# Altium project 230408 BSPD Current Sense Board R2.PrjPcb
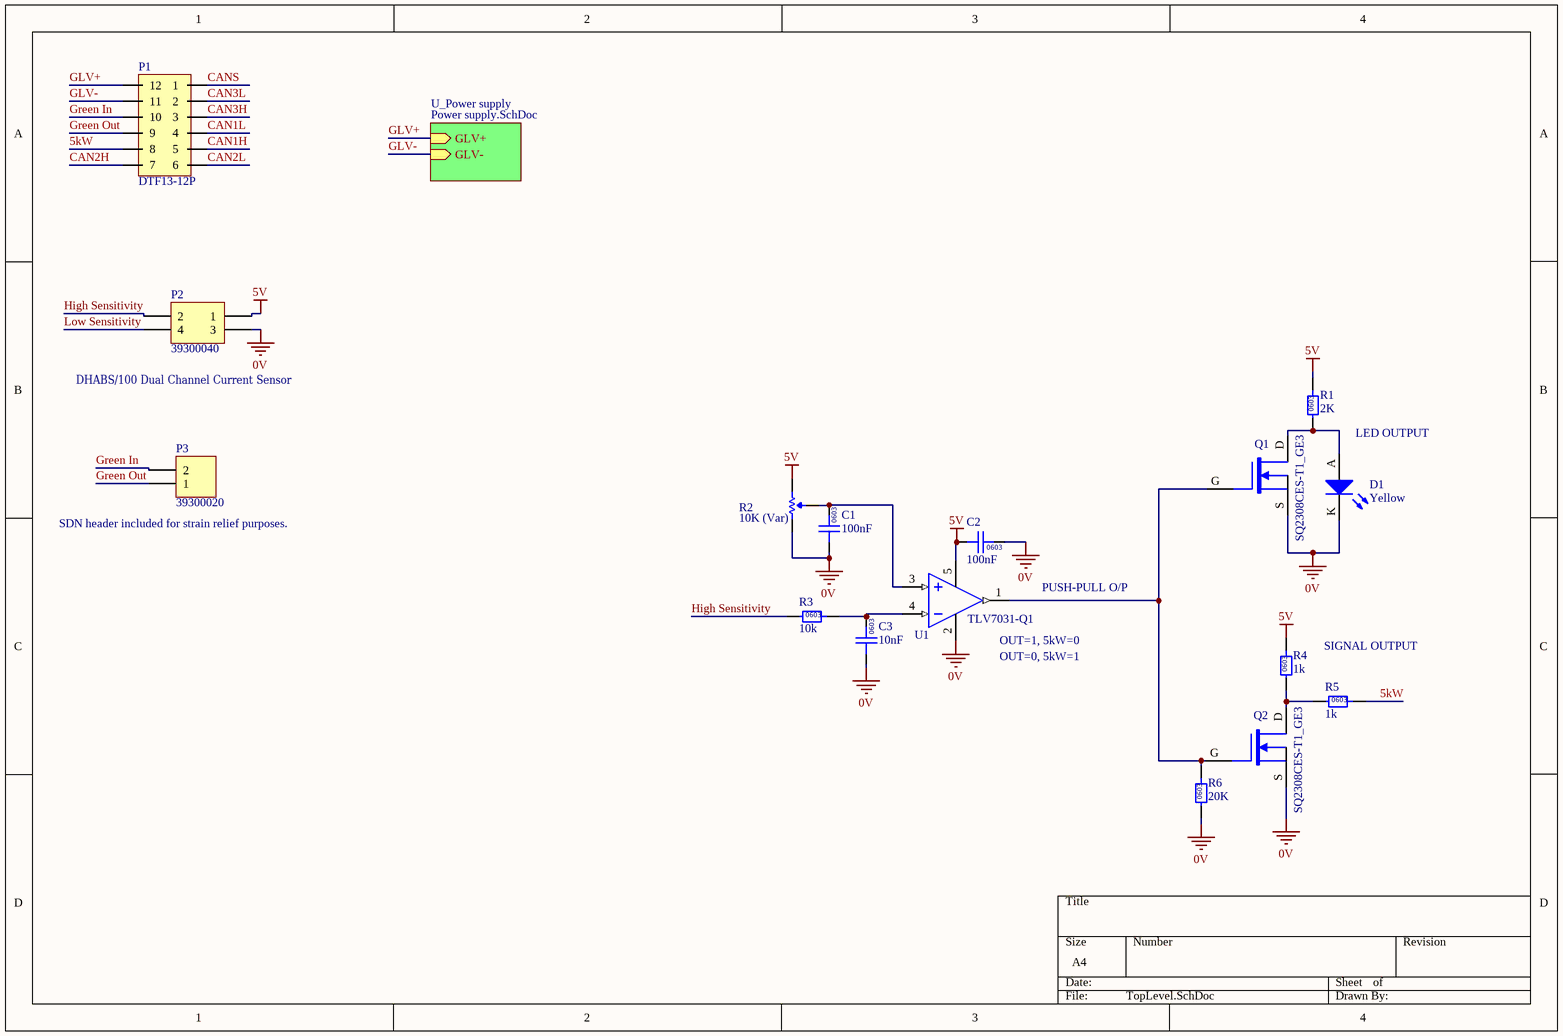
[diagram p0: TopLevel.SchDoc]
2 sheets, 36 parts. Net scope: hierarchical (ports join the sheet entries above them; power ports are global).
Board file: PCB.PcbDoc
Sheets:
  TopLevel.SchDoc
    U_Power supply = Power supply.SchDoc

## Sheet TopLevel.SchDoc
size A4

### Parts
C1  100nF  [0603]
C2  100nF  [0603]
C3  10nF  [0603]
D1  Yellow  [0805 LED]
P1  DTF13-12P  [DTF13-12P]
P2  39300040  [39300040]
P3  39300020  [39300020]
Q1  SQ2308CES-T1_GE3  [VSHY SOT-23-3]
Q2  SQ2308CES-T1_GE3  [VSHY SOT-23-3]
R1  2K  [0603]
R2  10K (Var)  [B 3296]
R3  10k  [0603]
R4  1k  [0603]
R5  1k  [0603]
R6  20K  [0603]
U1  TLV7031-Q1  [TI SOT-23-5]

### Sub-sheets
U_Power supply = Power supply.SchDoc: GLV+ (in), GLV- (in)

### Nets
0V: C1.1 C2.2 C3.1 D1.K P2.3 Q1.S Q2.S R2.3(CW) R6.1 U1.2(V-)
5V: C2.1 P2.1 R1.2 R2.1(CCW) R4.2 U1.5(Vcc)
5kW: P1.8 R5.2
CAN1H: P1.5
CAN1L: P1.4
CAN2H: P1.7
CAN2L: P1.6
CAN3H: P1.3
CAN3L: P1.2
CANS: P1.1
GLV+: P1.12 ; sheet U_Power supply/GLV+
GLV-: P1.11 ; sheet U_Power supply/GLV-
Green In: P1.10 P3.2
Green Out: P1.9 P3.1
High Sensitivity: P2.2 R3.1
Low Sensitivity: P2.4
NetC1_2: C1.2 R2.2(Wiper) U1.3(IN+)
NetC3_2: C3.2 R3.2 U1.4(IN-)
NetD1_A: D1.A Q1.D R1.1
NetQ1_G: Q1.G Q2.G R6.2 U1.1(OUT)
NetQ2_D: Q2.D R4.1 R5.1

### Notes on the sheet
- (near P2) DHAB​​S/100 Dual Channel Current Sensor
- LED OUTPUT
- (near P3) SDN header included for strain relief purposes.
- (near U1) OUT=1, 5kW=0
- PUSH-PULL O/P
- SIGNAL OUTPUT
- (near U1) OUT=0, 5kW=1
- (in symbol GCM188L81H103KA03D) 0603
- (in symbol GCM188L81H104KA57D) 0603
- (in symbol RC0603FR-071KL) 0603
- (in symbol RC0603FR-072KL) 0603
- (in symbol RC0603FR-0710KL) 0603
- (in symbol RC0603FR-0720KL) 0603

### Library data of the parts
C1 C2 = GCM188L81H104KA57D: Manufacturer: muRata; Rated Voltage: 50V; Tolerance: ±10%; Material: MLCC; Temperature Rating: X8L; Part Number: GCM188L81H104KA57D; Value: 100nF; Digikey Part Number: 490-6049-1-ND
C3 = GCM188L81H103KA03D: Manufacturer: muRata; Rated Voltage: 50V; Tolerance: ±10%; Material: MLCC; Temperature Rating: X8L; Part Number: GCM188L81H103KA03D; Value: 10nF; Digikey Part Number: 490-GCM188L81H103KA03DCT-ND
D1 = SML-211YTT86: Yellow LED Indication - Discrete 1.75V 0805 (2012 Metric); Manufacturer: ROHM Semiconductor; Part Number: SML-211YTT86; Colour: Yellow; Digikey Part Number: 511-1293-1-ND
P1 = DTF13-12P: Positions: 12; Pitch: 4.45mm; Angle: 90; Flange: No; Contact: Copper Alloy; Part Number: DTF13-12P; Row Spacing: 4.45mm; Digikey Part Number: 1734-1861-ND; Digikey Link: https://www.digikey.com/products/en?keywords=dtf13-12pa
P2 = 39300040: Pitch: 4.2mm; Row Spacing: 5.5mm; Angle: 90; Flange: No; Contact: Tin; Part Number: 39300040; Positions: 4; Digikey Part Number: WM21352-ND
P3 = 39300020: Pitch: 4.2mm; Row Spacing: 5.5mm; Angle: 90; Flange: No; Contact: Tin; Part Number: 39300020; Positions: 2; Digikey Part Number: WM21351-ND
Q1 Q2 = SQ2308CES-T1_GE3: MOSFET N-CH 60V 2.3A SOT23; Manufacturer: Vishay Siliconix; Type: N-channel; Rated Power: 2W; Published: 24-Mar-1999; LatestRevisionDate: 29-May-2009; LatestRevisionNote: IPC-7351 Footprint Added.; PackageVersion: Sep-2000; PackageReference: SOT-343; Publisher: Altium Limited; PackageDescription: 4-Pin SOT-343 Package 1.3 mm Pitch, 2.1 mm Lead Span; Part Number: SQ2308CES-T1_GE3; Digikey Part Number: SQ2308CES-T1_GE3CT-ND
R1 = RC0603FR-072KL: Manufacturer: YAGEO; Tolerance: 0.01; Rated Power: 0.1W; Part Number: RC0603FR-072KL; Value: 2K; Digikey Part Number: 311-2.00KHRCT-ND
R2 = 3296W-1-103LF: Manufacturer: Bournes Inc; Tolerance: 0.1; Rated Power: 0.5W; Part Number: 3296W-1-103LF; Value: 10K (Var); Digikey Part Number: 3296W-103LF-ND
R3 = RC0603FR-0710KL: Manufacturer: YAGEO; Tolerance: 0.01; Rated Power: 0.1W; Part Number: RC0603FR-0710KL; Value: 10k; Digikey Part Number: 311-10.0KHRCT-ND
R4 R5 = RC0603FR-071KL: Manufacturer: YAGEO; Tolerance: 0.01; Rated Power: 0.1W; Part Number: RC0603FR-071KL; Value: 1k; Digikey Part Number: 311-1.00KHRCT-ND
R6 = RC0603FR-0720KL: Manufacturer: YAGEO; Tolerance: 0.01; Rated Power: 0.1W; Part Number: RC0603FR-0720KL; Value: 20K; Digikey Part Number: 311-20.0KHRCT-ND
U1 = TLV7031-Q1: Manufacturer: Texas Instruments; Input Voltage: 1.6 to 6.5 V; Channels: 1; Output: Push-Pull; Part Number: TLV7031-Q1; Digikey Part Number: 296-TLV7031QDBVRQ1CT-ND

## Sheet Power supply.SchDoc
size A4; SheetNumber: 1; SheetTotal: 1
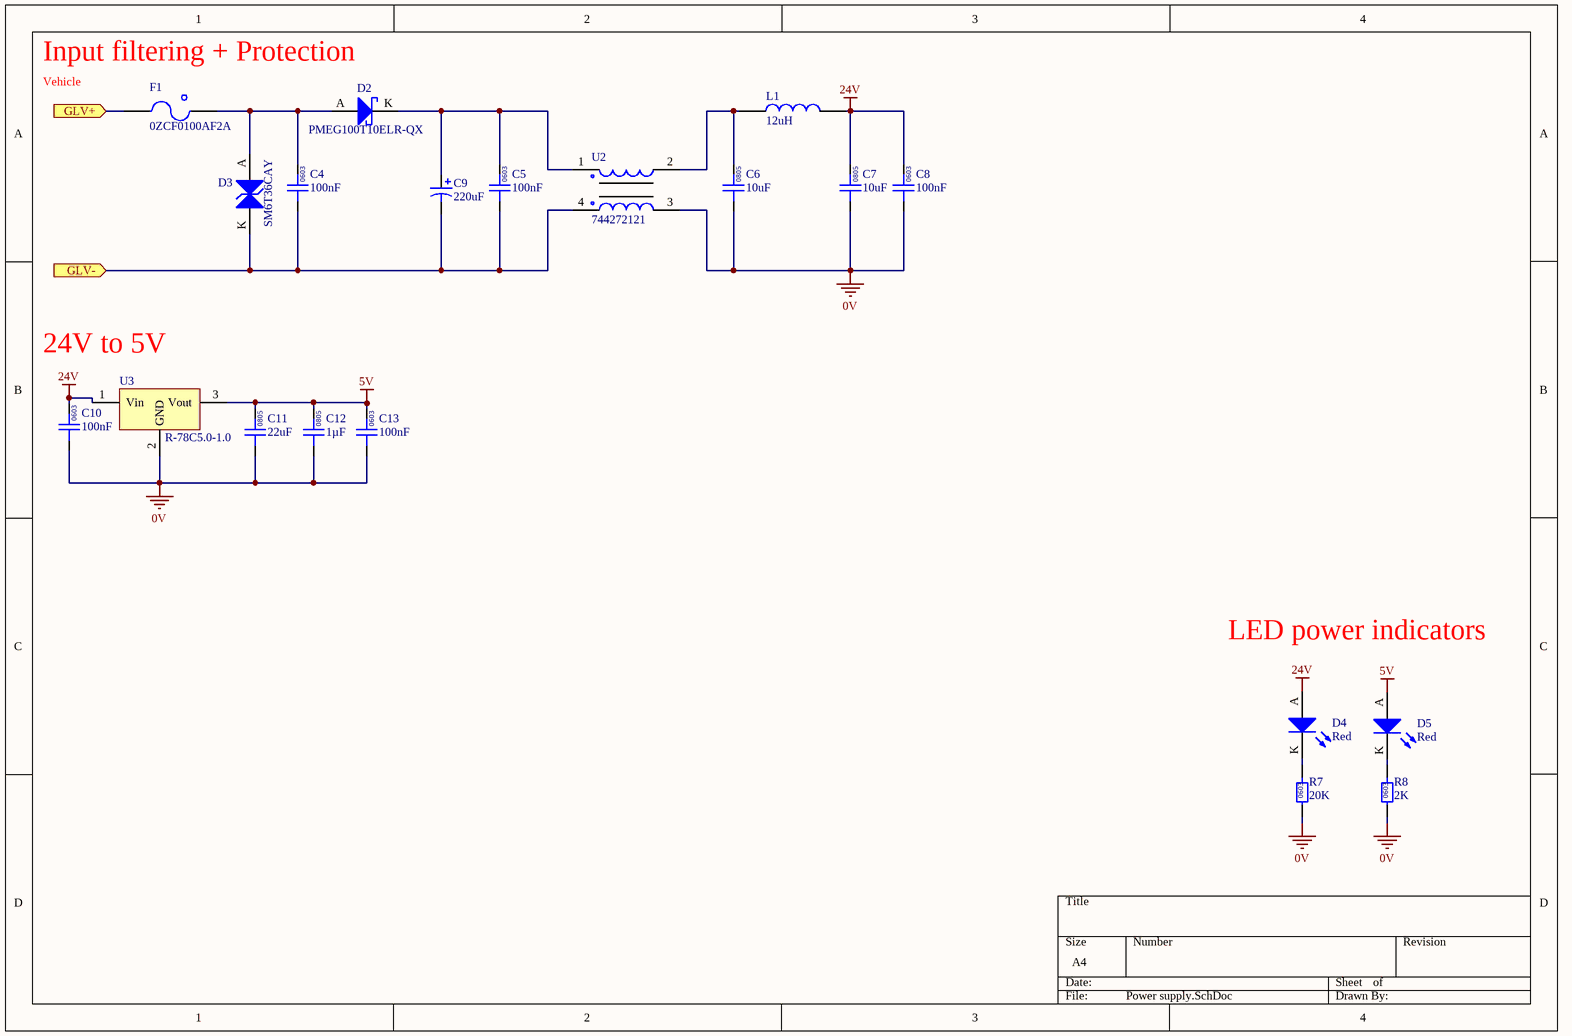
[diagram p1: Power supply.SchDoc]

### Parts
C4  100nF  [0603]
C5  100nF  [0603]
C6  10uF  [0805]
C7  10uF  [0805]
C8  100nF  [0603]
C9  220uF  [Vishay Radial 1213]
C10  100nF  [0603]
C11  22uF  [0805]
C12  1µF  [0805]
C13  100nF  [0603]
D2  PMEG100T10ELR-QX  [NXP SOD123W]
D3  SM6T36CAY  [ST SMB DIODE]
D4  Red  [0805 LED]
D5  Red  [0805 LED]
F1  0ZCF0100AF2A  [2920]
L1  12uH  [1812]
R7  20K  [0603]
R8  2K  [0603]
U2  744272121  [Wurth 4-PC Pad]
U3  R-78C5.0-1.0  [RECOM 3-SIP]

### Ports
GLV+ (in), GLV- (in)

### Nets
0V: C6.1 C7.1 C8.1 C10.1 C11.1 C12.1 C13.1 R7.1 R8.1 U2.3 U3.2(GND)
5V: C11.2 C12.2 C13.2 D5.A U3.3(Vout)
24V: C7.2 C8.2 C10.2 D4.A L1.1 U3.1(Vin)
GLV+: F1.1 ; port GLV+
GLV-: C4.1 C5.1 C9.1 D3.K U2.4 ; port GLV-
NetC4_2: C4.2 D2.A D3.A F1.2
NetC5_2: C5.2 C9.2 D2.K U2.1
NetC6_2: C6.2 L1.2 U2.2
NetD4_K: D4.K R7.2
NetD5_K: D5.K R8.2

### Notes on the sheet
- Input filtering + Protection
- Vehicle
- 24V to 5V
- LED power indicators
- (in symbol GCM21BR71H105KA03L) 0805
- (in symbol GCM188L81H104KA57D) 0603
- (in symbol GRM21BR6YA106KE43L) 0805
- (in symbol GRM21BR61A226ME51L) 0805
- (in symbol RC0603FR-072KL) 0603
- (in symbol RC0603FR-0720KL) 0603

### Library data of the parts
C4 C5 C8 C10 C13 = GCM188L81H104KA57D: as C1 on sheet TopLevel; Part Number: GCM188L81H104KA57D; Value: 100nF; Digikey Part Number: 490-6049-1-ND
C6 C7 = GRM21BR6YA106KE43L: Manufacturer: muRata; Rated Voltage: 50V; Tolerance: 10%; Material: MLCC; Temperature Rating: X5R; Part Number: GRM21BR6YA106KE43L; Value: 10uF; Digikey Part Number: 490-10514-6-ND
C9 = MAL214699106E3: Manufacturer: Vishay; Rated Voltage: 50V; Tolerance: 20%; Material: Aluminium Electrolytic; Temperature Rating: 125C; Part Number: MAL214699106E3; Value: 220uF; Digikey Part Number: 4440PHCT-ND
C11 = GRM21BR61A226ME51L: Manufacturer: muRata; Rated Voltage: 10V; Tolerance: 20%; Material: MLCC; Temperature Rating: X5R; Part Number: GRM21BR61A226ME51L; Value: 22uF; Digikey Part Number: 490-10511-1-ND
C12 = GCM21BR71H105KA03L: Manufacturer: muRata; Rated Voltage: 50V; Tolerance: ±10%; Material: MLCC; Temperature Rating: X7R; Part Number: GCM21BR71H105KA03L; Value: 1µF; Digikey Part Number: 490-10675-1-ND
D2 = PMEG100T10ELR-QX: Manufacturer: Nexperia USA Inc.; Forward Voltage: 0.75 V @ 1A; Breakdown Voltage: 100 V; Rated Power: 680 mW; Part Number: PMEG100T10ELR-QX; Digikey Part Number: 1727-PMEG100T10ELR-QXCT-ND
D3 = SM6T36CAY: Manufacturer: STMicroelectronics; Forward Voltage: 30.8 V; Rated Power: 600W; Part Number: SM6T36CAY; Breakdown Voltage: 30.8 V; Digikey Part Number: 497-10804-1-ND
D4 D5 = SML-210LTT86: Red LED Indication - Discrete 1.75V 0805 (2012 Metric); Manufacturer: ROHM Semiconductor; Part Number: SML-210LTT86; Colour: Red; Digikey Part Number: 511-1286-1-ND
F1 = 0ZCF0100AF2A: PTC RESET FUSE 60V 1A 292; Manufacturer: Littelfuse Inc.; Part Number: 0ZCF0100AF2A; Digikey Part Number: 507-2070-1-ND; Digikey Link: https://www.digikey.com/product-detail/en/bel-fuse-inc/0ZCF0100AF2A/507-2070-1-ND/6210547
L1 = RLS-126: Manufacturer: Recom; Tolerance: 0.2; Material: Wirewound; Impedance: 230mOhm; Rated Current: 0.8 A; Part Number: RLS-126; Value: 12uH; Digikey Part Number: 945-3429-ND
R7 = RC0603FR-0720KL: as R6 on sheet TopLevel; Part Number: RC0603FR-0720KL; Value: 20K; Digikey Part Number: 311-20.0KHRCT-ND
R8 = RC0603FR-072KL: as R1 on sheet TopLevel; Part Number: RC0603FR-072KL; Value: 2K; Digikey Part Number: 311-2.00KHRCT-ND
U2 = 744272121: Manufacturer: Wurth Electronics Inc; Value: 120uH @ 100kHz; Impedance: 460 Ohms @ 30MHz; Rated Current: 2.5 A; Part Number: 744272121; Material: Wirewound; Digikey Part Number: 732-1489-1-ND
U3 = R-78C5.0-1.0: CONV DC/DC 1A 5V OUT SIP VERT; Manufacturer: Recom; Input Voltage: 8 to 42 V; Output Current: 1.0 A; Part Number: R-78C5.0-1.0; Output Voltage: 5V; Digikey Part Number: 945-1395-5-ND

## Nets that join several sheets
0V: TopLevel (10 pins), Power supply (11 pins)
5V: TopLevel (6 pins), Power supply (5 pins)
GLV+: TopLevel (P1.12), Power supply (F1.1)
GLV-: TopLevel (P1.11), Power supply (5 pins)